# EAGLE design Sport Analyzer Chronojump Teensy 4 (4 buttons) Load cell 160Hz (EAGLE 9.6.2)
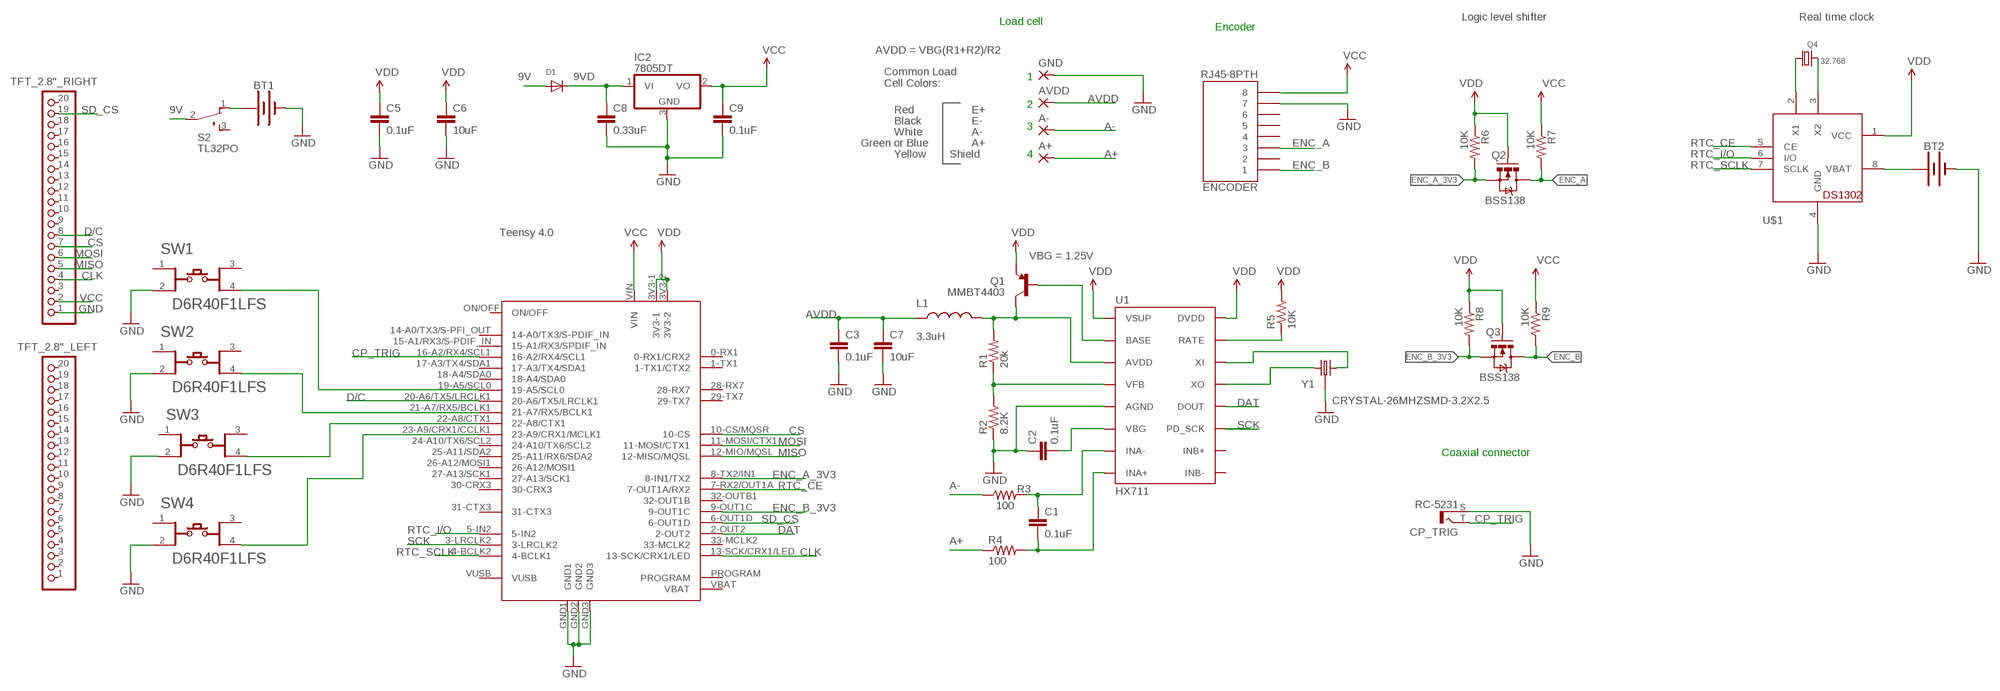
[diagram p0: schematic, sheet 1]

## Parts
A+  3,81/1,4  [3,81/1,4]
A-  3,81/1,4  [3,81/1,4]
AVDD  3,81/1,4  [3,81/1,4]
BT1  BATTERY-9V  [BATTCON_9V]
BT2  BATTERY-12MM_SMD  [BATTCON_12MM]
C1  0.1uF  0.1UF-25V-5%(0603)  [0603-CAP]
C2  0.1uF  0.1UF-25V-5%(0603)  [0603-CAP]
C3  0.1uF  0.1UF-25V-5%(0603)  [0603-CAP]
C5  0.1uF  0.1UF-25V-5%(0603)  [0603-CAP]
C6  10uF  10UF50V20%(1210)  [1210]
C7  10uF  10UF50V20%(1210)  [1210]
C8  0.33uF  0.1UF-25V-5%(0603)  [0603-CAP]
C9  0.1uF  0.1UF-25V-5%(0603)  [0603-CAP]
CP_TRIG  RC-5231  [RC-5231]
D1  DIODESOD-123  [SOD-123]
ENCODER  RJ45-8PTH  [RJ45-8]
GND  3,81/1,4  [3,81/1,4]
IC2  7805DT  [TO252]
L1  3.3uH  INDUCTOR0805-IND  [0805]
Q1  MMBT4403  TRANSISTOR_PNPMMBT4403  [SOT23-3]
Q2  BSS138  MOSFET-NCHANNELSMD  [SOT23-3]
Q3  BSS138  MOSFET-NCHANNELSMD  [SOT23-3]
Q4  32.768  CRYSTAL8.0X3.8  [CRYSTAL_8X3.8]
R1  20k  20KOHM1/10W1%(0603)  [0603-RES]
R2  8.2K  8.2KOHM-1/10W-5%(0603)  [0603-RES]
R3  100  100OHM-1/10W-1%(0603)  [0603-RES]
R4  100  100OHM-1/10W-1%(0603)  [0603-RES]
R5  10K  10KOHM-1/10W-1%(0603)0603  [0603-RES]
R6  10K  RESISTOR0603-RES  [0603-RES]
R7  10K  RESISTOR0603-RES  [0603-RES]
R8  10K  RESISTOR0603-RES  [0603-RES]
R9  10K  RESISTOR0603-RES  [0603-RES]
S2  TL32PO  [TL3XPO]
SW1  C&K_COMPONENTS_D6R40F1LFSC&K_COMPONENTS_D6R40F1LFS_0_0  [C&K_COMPONENTS_D6R40F1LFS_0]
SW2  C&K_COMPONENTS_D6R40F1LFSC&K_COMPONENTS_D6R40F1LFS_0_0  [C&K_COMPONENTS_D6R40F1LFS_0]
SW3  C&K_COMPONENTS_D6R40F1LFSC&K_COMPONENTS_D6R40F1LFS_0_0  [C&K_COMPONENTS_D6R40F1LFS_0]
SW4  C&K_COMPONENTS_D6R40F1LFSC&K_COMPONENTS_D6R40F1LFS_0_0  [C&K_COMPONENTS_D6R40F1LFS_0]
TFT_2.8"_LEFT  PINHD-1X20  [1X20]
TFT_2.8"_RIGHT  PINHD-1X20  [1X20]
U1  HX711  HX711HX711  [SO16]
U$1  DS1302  [DIL08-ROUND]
U$2  TEENSY40  [TEENSY40]
Y1  CRYSTAL-26MHZSMD-3.2X2.5  [CRYSTAL-SMD-3.2X2.5MM]

## Nets
9V: D1.A S2.2(P)
9VD: C8.1 D1.C IC2.1(VI)
A+: A+.1(P) R4.1
A-: A-.1(P) R3.1
AVDD: AVDD.1(P) C3.1 C7.1 L1.1
CLK: TFT_2.8"_RIGHT.4 U$2.13-SCK/CRX1/LED
CP_TRIG: CP_TRIG.T U$2.16-A2/RX4/SCL1
CS: TFT_2.8"_RIGHT.7 U$2.10-CS/MQSR(10-CS)
D/C: TFT_2.8"_RIGHT.8 U$2.20-A6/TX5/LRCLK1
DAT: U1.12(DOUT) U$2.2-OUT2
ENC_A: ENCODER.3 Q2.3(D) R7.2
ENC_A_3V3: Q2.2(S) R6.2 U$2.8-TX2/IN1(8-IN1/TX2)
ENC_B: ENCODER.1 Q3.3(D) R9.2
ENC_B_3V3: Q3.2(S) R8.2 U$2.9-OUT1C
GND: BT1.- BT2.GND(-) C2.1 C3.2 C5.2 C6.2 C7.2 C8.2 C9.2 CP_TRIG.S ENCODER.7 GND.1(P) IC2.3(GND) R2.1 SW1.2 SW2.2 SW3.2 SW4.2 TFT_2.8"_RIGHT.1 U1.5(AGND) U$1.4(GND) U$2.GND1 U$2.GND2 U$2.GND3 Y1.2(GND) Y1.4(GND)
MISO: TFT_2.8"_RIGHT.5 U$2.12-MIO/MQSL(12-MISO/MQSL)
MOSI: TFT_2.8"_RIGHT.6 U$2.11-MOSI/CTX1
N$1: R5.1 U1.15(RATE)
N$2: C1.1 R3.2 U1.7(INA-)
N$3: C1.2 R4.2 U1.8(INA+)
N$4: Q1.1(B) U1.2(BASE)
N$5: L1.2 Q1.3(C) R1.2 U1.3(AVDD)
N$6: R1.1 R2.2 U1.4(VFB)
N$7: C2.2 U1.6(VBG)
N$8: Q4.P$4 U$1.2(X1)
N$9: Q4.P$1 U$1.3(X2)
N$10: SW1.4 U$2.19-A5/SCL0
N$11: SW2.4 U$2.21-A7/RX5/BCLK1
N$12: SW3.4 U$2.22-A8/CTX1
N$13: SW4.4 U$2.23-A9/CRX1/CCLK1(23-A9/CRX1/MCLK1)
N$14: U1.13(XO) Y1.1
N$15: U1.14(XI) Y1.3
N$18: BT2.PWR@1(+) U$1.8(VBAT)
N$42: BT1.+ S2.1(O)
RTC_CE: U$1.5(CE) U$2.7-RX2/OUT1A(7-OUT1A/RX2)
RTC_I/O: U$1.6(I/O) U$2.5-IN2
RTC_SCLK: U$1.7(SCLK) U$2.4-BCLK2(4-BCLK1)
SCK: U1.11(PD_SCK) U$2.3-LRCLK2
SD_CS: TFT_2.8"_RIGHT.19 U$2.6-OUT1D
VCC: C9.1 ENCODER.8 IC2.2(VO) R7.1 R9.1 TFT_2.8"_RIGHT.2 U$2.VIN
VDD: C5.1 C6.1 Q1.2(E) Q2.1(G) Q3.1(G) R5.2 R6.1 R8.1 U1.1(VSUP) U1.16(DVDD) U$1.1(VCC) U$2.3V3-1 U$2.3V3-2
Unconnected: ENCODER.2 ENCODER.4 ENCODER.5 ENCODER.6 S2.3(S) SW1.1 SW1.3 SW2.1 SW2.3 SW3.1 SW3.3 SW4.1 SW4.3 TFT_2.8"_LEFT.1 TFT_2.8"_LEFT.2 TFT_2.8"_LEFT.3 TFT_2.8"_LEFT.4 TFT_2.8"_LEFT.5 TFT_2.8"_LEFT.6 TFT_2.8"_LEFT.7 TFT_2.8"_LEFT.8 TFT_2.8"_LEFT.9 TFT_2.8"_LEFT.10 TFT_2.8"_LEFT.11 TFT_2.8"_LEFT.12 TFT_2.8"_LEFT.13 TFT_2.8"_LEFT.14 TFT_2.8"_LEFT.15 TFT_2.8"_LEFT.16 TFT_2.8"_LEFT.17 TFT_2.8"_LEFT.18 TFT_2.8"_LEFT.19 TFT_2.8"_LEFT.20 TFT_2.8"_RIGHT.3 TFT_2.8"_RIGHT.9 TFT_2.8"_RIGHT.10 TFT_2.8"_RIGHT.11 TFT_2.8"_RIGHT.12 TFT_2.8"_RIGHT.13 TFT_2.8"_RIGHT.14 TFT_2.8"_RIGHT.15 TFT_2.8"_RIGHT.16 TFT_2.8"_RIGHT.17 TFT_2.8"_RIGHT.18 TFT_2.8"_RIGHT.20 U1.9(INB-) U1.10(INB+) U$2.0-RX1(0-RX1/CRX2) U$2.1-TX1(1-TX1/CTX2) U$2.14-A0/TX3/S-PFI_OUT(14-A0/TX3/S-PDIF_IN) U$2.15-A1/RX3/S-PDIF_IN(15-A1/RX3/SPDIF_IN) U$2.17-A3/TX4/SDA1 U$2.18-A4/SDA0 U$2.24-A10/TX6/SCL2 U$2.25-A11/SDA2(25-A11/RX6/SDA2) U$2.26-A12/MOSI1 U$2.27-A13/SCK1 U$2.28-RX7 U$2.29-TX7 U$2.30-CRX3 U$2.31-CTX3 U$2.32-OUTB1(32-OUT1B) U$2.33-MCLK2 U$2.ON/OFF U$2.PROGRAM U$2.VBAT U$2.VUSB

## Notes on the sheet
- Logic level shifter | Real time clock
- Load cell
- Encoder
- AVDD = VBG(R1+R2)/R2
- 1
- Common Load
  Cell Colors:
- 2
- Red | E+
- Black | E-
- 3
- White | A-
- Green or Blue | A+
- Yellow | Shield | 4
- Teensy 4.0
- VBG = 1.25V
- Coaxial connector

## Library data of the parts
A+ A- AVDD GND = wirepad_xavi:3,81/1,4: THROUGH-HOLE PAD
BT1 = SparkFun-Batteries:BATTERY: Battery - Single Cell A variety of battery chemistries, sizes, and footprints. Device List: 20MM_PTH - Coin Cell Battery Holder - 20mm (PTH) <https://www.sparkfun.com/products/783> 20MM_PTH_KIT- Coin Cell battery Holder - 20 mm (PTH) <http://www.sparkfun.com/products/783>kit version with special mask 6.8MM_PTH - Coin Cell Battery Holder - 6.8MM(SMD) <https://www.digikey.com/product-detail/en/seiko-instruments/MS621FE-FL11E/728-1057-ND/1889208?WT.srch=1&gclid=CNOQ5a6LzdQCFZS2wAodXCkE0g> 12MM_SMD - Coin Cell Battery Holder - 12mm (SMD) <https://www.sparkfun.com/products/10592> 12MM_PTH - Coin Cell Battery Holder - 12mm (PTH) <https://www.sparkfun.com/products/7948> 20MM_SMD - 20mm Coin Cell Battery Holder (SMD) (2 legs) Used on the Big Time Watch Kit <https://www.sparkfun.com/products/11734> 20MM_SMD_4LEGS - Coin Cell Battery Holder - 20mm (SMD) <https://www.sparkfun.com/products/11892> 20MM_SMD_4LEGS_OVERPASTE - Coin Cell Battery Holder - 20mm (SMD) <https://www.sparkfun.com/products/11892> (Over-paste on the legs) 24.5MM_PTH - Coin Cell Battery Holder - 24.5mm (PTH) <https://www.sparkfun.com/products/8863> 9V - 9V Battery Holder - PC Mount Used on the SparkFun SparkPunk Sound Kit <https://www.sparkfun.com/products/11177> and SparkFun SparkPunk Sequencer Kit <https://www.sparkfun.com/products/12707> 18650 - Battery Holder - 18650 (PTH) <https://www.sparkfun.com/products/13113> AA - Battery Holder - 1xAA (PTH) <https://www.sparkfun.com/products/7949> AAA - Battery Holder - 1xAAA (PTH) <https://www.sparkfun.com/products/12718> AA_KIT - Battery Holder - 1xAA (PTH) <https://www.sparkfun.com/products/7949> Special kit package - pads only have exposed copper on one side of the board. AAA_KIT - Battery Holder - 1xAAA (PTH) <https://www.sparkfun.com/products/12718> Special kit package - pads only have exposed copper on one side of the board.; PROD_ID: BATT-10855
BT2 = SparkFun-Batteries:BATTERY: Battery - Single Cell A variety of battery chemistries, sizes, and footprints. Device List: 20MM_PTH - Coin Cell Battery Holder - 20mm (PTH) <https://www.sparkfun.com/products/783> 20MM_PTH_KIT- Coin Cell battery Holder - 20 mm (PTH) <http://www.sparkfun.com/products/783>kit version with special mask 6.8MM_PTH - Coin Cell Battery Holder - 6.8MM(SMD) <https://www.digikey.com/product-detail/en/seiko-instruments/MS621FE-FL11E/728-1057-ND/1889208?WT.srch=1&gclid=CNOQ5a6LzdQCFZS2wAodXCkE0g> 12MM_SMD - Coin Cell Battery Holder - 12mm (SMD) <https://www.sparkfun.com/products/10592> 12MM_PTH - Coin Cell Battery Holder - 12mm (PTH) <https://www.sparkfun.com/products/7948> 20MM_SMD - 20mm Coin Cell Battery Holder (SMD) (2 legs) Used on the Big Time Watch Kit <https://www.sparkfun.com/products/11734> 20MM_SMD_4LEGS - Coin Cell Battery Holder - 20mm (SMD) <https://www.sparkfun.com/products/11892> 20MM_SMD_4LEGS_OVERPASTE - Coin Cell Battery Holder - 20mm (SMD) <https://www.sparkfun.com/products/11892> (Over-paste on the legs) 24.5MM_PTH - Coin Cell Battery Holder - 24.5mm (PTH) <https://www.sparkfun.com/products/8863> 9V - 9V Battery Holder - PC Mount Used on the SparkFun SparkPunk Sound Kit <https://www.sparkfun.com/products/11177> and SparkFun SparkPunk Sequencer Kit <https://www.sparkfun.com/products/12707> 18650 - Battery Holder - 18650 (PTH) <https://www.sparkfun.com/products/13113> AA - Battery Holder - 1xAA (PTH) <https://www.sparkfun.com/products/7949> AAA - Battery Holder - 1xAAA (PTH) <https://www.sparkfun.com/products/12718> AA_KIT - Battery Holder - 1xAA (PTH) <https://www.sparkfun.com/products/7949> Special kit package - pads only have exposed copper on one side of the board. AAA_KIT - Battery Holder - 1xAAA (PTH) <https://www.sparkfun.com/products/12718> Special kit package - pads only have exposed copper on one side of the board.; PROD_ID: BATT-08044; SF_SKU: PRT-10592
C1-C3 C5 C9 = SparkFun-Capacitors:0.1UF-25V-5%(0603): CAP-08604; PROD_ID: CAP-08604
C6 C7 = SparkFun-Capacitors:10UF50V20%(1210): CAP-09824; PROD_ID: CAP-09824
C8 = SparkFun-Capacitors:0.1UF-25V-5%(0603): CAP-08604; PROD_ID: CAP-08604; VALUE: 0.1uF
CP_TRIG = con-lumberg:RC-5231: RCA connectors according to JEITA RC-5231 RCA-Steckverbinder nach JEITA RC-5231 Source: RCA- Stecker 2poolig.pdf
D1 = adafruit:DIODE: Diode SMADIODE - SMA Surface Mount Package 20V 1A Schottky Diode Digikey: 641-1014-6-ND DO-1N4148 - Through Hole Small Current Diode SOD-123 20V 1 A (.5mV Vf) Schottky Diode - Digikey: MBRX120TPMSCT-ND SOD-323 10V 570mA (.38mV Vf, 3ns) Schottky Diode - Digikey: ZLLS410CT-ND SOD-523 30V 30mA Schottky Diode (RB751S-40TE61) - Digikey: RB751S-40TE61CT-ND SOT23-R/W - SOT23 Package (R = Solder Paste/Reflow Ovens, W = Hand-Soldering) BAT54Film 40V 300mA - Digikey: 497-7162-1-ND
ENCODER = SparkFun:RJ45-8: RJ45 Jack Simple RJ45, 8-pin connection - connector for common Cat5, Cat5e, and Cat6 Ethernet cables. Footprint not yet proven in production. Connector sku is PRT-00643; Breakout PCB sku is BOB-00716.
IC2 = linear:78*: Positive VOLTAGE REGULATOR Source: http://cache.national.com/ds/LM/LM78L05.pdf http://www.fairchildsemi.com/ds/LM/LM7805.pdf
L1 = SparkFun-Passives:INDUCTOR: Inductors Basic Inductor/Choke - 0603 and 1206. Footprints are not proven and vary greatly between part numbers. INDUCTOR POWER 3.3UH 4.0A SMD 0.197" L x 0.197" W x 0.177" H (5.00mm x 5.00mm x 4.50mm); PROD_ID: NDUC-13076
Q1 = SparkFun-DiscreteSemi:TRANSISTOR_PNP: Generic PNP BJT Double check pinouts against datasheets- not all devices are the same! MMBT3906 - 40V 200mA SOT-23 (TRANS-08052) MMBT4403 - 40V 600mA SOT-23 (TRANS-09245); PROD_ID: TRANS-09245
Q2 Q3 = SparkFun:MOSFET-NCHANNEL
Q4 = microbuilder:CRYSTAL: Crystals HC49UP - Surface Mount Crystal 4.0MHz 18pF +/-30ppm Surface Mount Crystal [Digikey: 535-9857-1-ND] 12.0 MHz Surface Mount Crystal [Digikey: 535-9869-6-ND] 25.0 MHz Surface Mount Crystal [Digikey: 535-9078-1-ND] 2.5 x 2.0mm - MEMs SMT Crystal 16.0 MHz 10pF 20ppm 2.5 x 2.0mm Crystal [Digikey -40-85°C: 535-10923-1-ND] 3.2 x 2.5mm - MEMs SMT Crystal 12.0 MHz 8pF 15ppm 3.2 x 2.5mm Crystal [Digikey: -10-70°C: 644-1047-1-ND -40-125°C: 644-1128-1-ND] 40~85°C cheaper: 644-1173-6-ND 16.0 MHz 8pF 15ppm 3.2 x 2.5mm Crystal [Digikey: -10-70°C: 644-1049-1-ND -40-125°C: 644-1129-2-ND]-40~85°C cheaper: 644-1175-6-ND 16.0 MHz 10pF 10ppm 3.2 x 2.5mm Crystal [Digikey: 644-1100-1-ND] 27.12 MHz 18pF 30ppm 3.2 x 2.5mm Crystal [Digikey: 887-1424-1-ND] 27.12MHz 10pF 10ppm 3.2 x 2.5mm Crystal [Digikey: 887-1329-1-ND] 4.9 x 1.8mm - MEMs SMT Crystal 32.768 KHz 12.5pF 20ppm 4.9 x 1.8mm Crystal [Digikey: SE2415CT-ND] 8.0 x 3.8mm - Surface Mount Crystal 32.768kHz 12.5pF 20ppm -40°C-85°C [Digikey: 535-9166-2-ND] Cylinder 32.768KHz Cylinder Crystal (2x6mm body) [Ex. Digikey: 300-8341-2-ND]
R1 = SparkFun-Resistors:20KOHM1/10W1%(0603): RES-09383; PROD_ID: RES-09383
R2 = SparkFun-Resistors:8.2KOHM-1/10W-5%(0603): RES-10646; PROD_ID: RES-10646
R3 R4 = SparkFun-Resistors:100OHM-1/10W-1%(0603): RES-07863; PROD_ID: RES-07863
R5 = SparkFun-Resistors:10KOHM-1/10W-1%(0603): RES-00824; PROD_ID: RES-00824
R6-R9 = SparkFun:RESISTOR: Resistor Basic schematic elements and footprints for 0603, 1206, and PTH resistors.
S2 = switch:TL32PO: TINY SWITCH ON - MOM Source: http://www2.produktinfo.conrad.com/datenblaetter/700000-724999/705152-da-01-de-Subminiaturschalter_TL_36YO.pdf
SW1-SW4 = C&K Components - D6R40F1LFS:C&K_COMPONENTS_D6R40F1LFS: Pushbutton Switch SPST-NO, RED, 0.1A, 32VDC, Through Hole; AUTOMOTIVE: No; CENTROID_NOT_SPECIFIED: No; CONTACT_CURRENT_RATING: 100mA; CONTACT_RESISTANCE: 100mΩ; DATASHEET: https://www.ckswitches.com/media/1341/d6.pdf; DEVICE_CLASS_L1: Electromechanical; DEVICE_CLASS_L2: Switches; DEVICE_CLASS_L3: Pushbutton Switches; DIGIKEY_DESCRIPTION: SWITCH PUSH SPST-NO 0.1A 32V; DIGIKEY_PART_NUMBER: 401-1975-ND; ELECTROMECHANICAL_LIFE: 250000Cycles; FOOTPRINT_VARIANT_NAME_0: Recommended_Land_Pattern; HEIGHT: 14.3mm; LEAD_FREE: Yes; MF: C&K Components; MFG_PACKAGE_IDENT: 0; MFG_PACKAGE_IDENT_DATE: 0; MFG_PACKAGE_IDENT_REV: 0; MOUNT: Through Hole; MOUSER_DESCRIPTION: Switch; P/B; Keyswitch; SPST-NO; OFF-MOM; Red Round Actuator; 100mA; 32VDC; PC Pins; MOUSER_PART_NUMBER: 611-D6R40F1LFS; MPN: D6R40F1LFS; OPERATING_FORCE: 1.3N; PACKAGE: PTH_SW_12MM0; PREFIX: SW; ROHS: Yes; STANDOFF_HEIGHT: 1.5mm; TEMPERATURE_RANGE_HIGH: +85°C; TEMPERATURE_RANGE_LOW: -20°C; THROW_CONFIGURATION: SPST-NO; VERIFICATION_VERSION: 0.0.0.3; VOLTAGE_RATING_DC: 32V
TFT_2.8"_LEFT TFT_2.8"_RIGHT = pinhead:PINHD-1X20: PIN HEADER
U1 = Testing:HX711; PROD_ID: IC-12445
U$1 = adafruit:DS1302: DS1302 - Real time clock with supercap trickle charger
U$2 = teensy:TEENSY40: Teensy 4.0 device including POGO pins for pins 24 - 33, but not yet pins for D+ and D-. Symbol layout is what works for me and may not suite everyone... that can be added or additional symbols can be created to be used in a modilied davie name.
Y1 = SparkFun-Clocks:CRYSTAL-26MHZ: 26MHz Crystal w/ Ground Pin Digikey Example <http://www.digikey.com/product-detail/en/epson/TSX-3225%2026.0000MF09Z-AC3/SER3627CT-ND/1802878> Frequency: 26MHz Frequency Stability: ±9ppm Frequency Tolerance: ±10ppm Load Capacitance: 9pF SparkFun Products: SparkFun ESP32 Thing <https://www.sparkfun.com/products/13907> SparkFun ESP8266 Thing Dev Board <https://www.sparkfun.com/products/13711>; PROD_ID: XTAL-12454

## Board
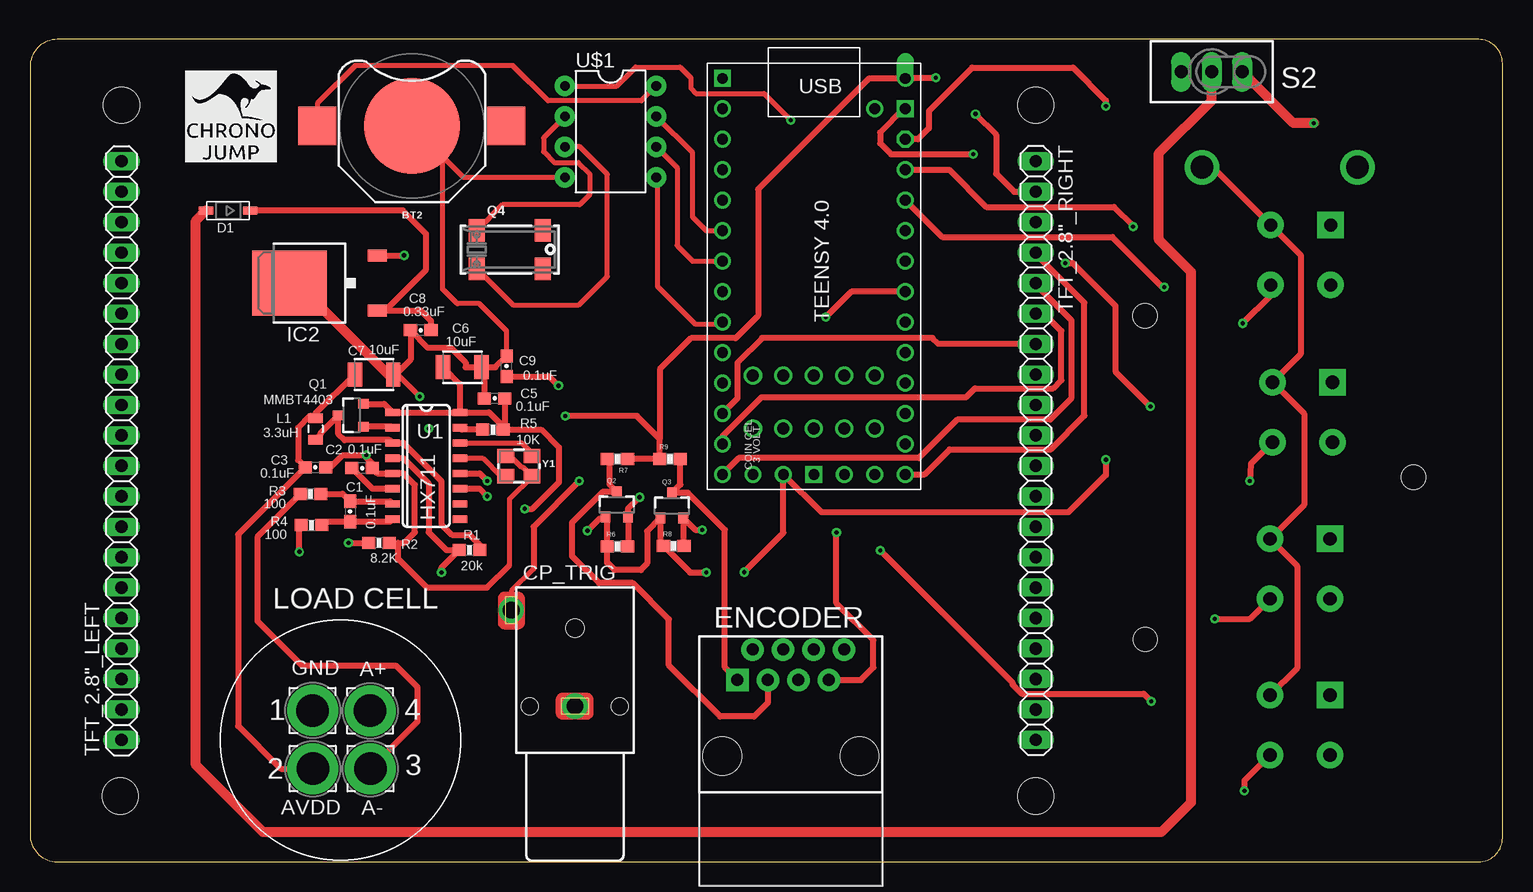
[diagram p1: board, top side]
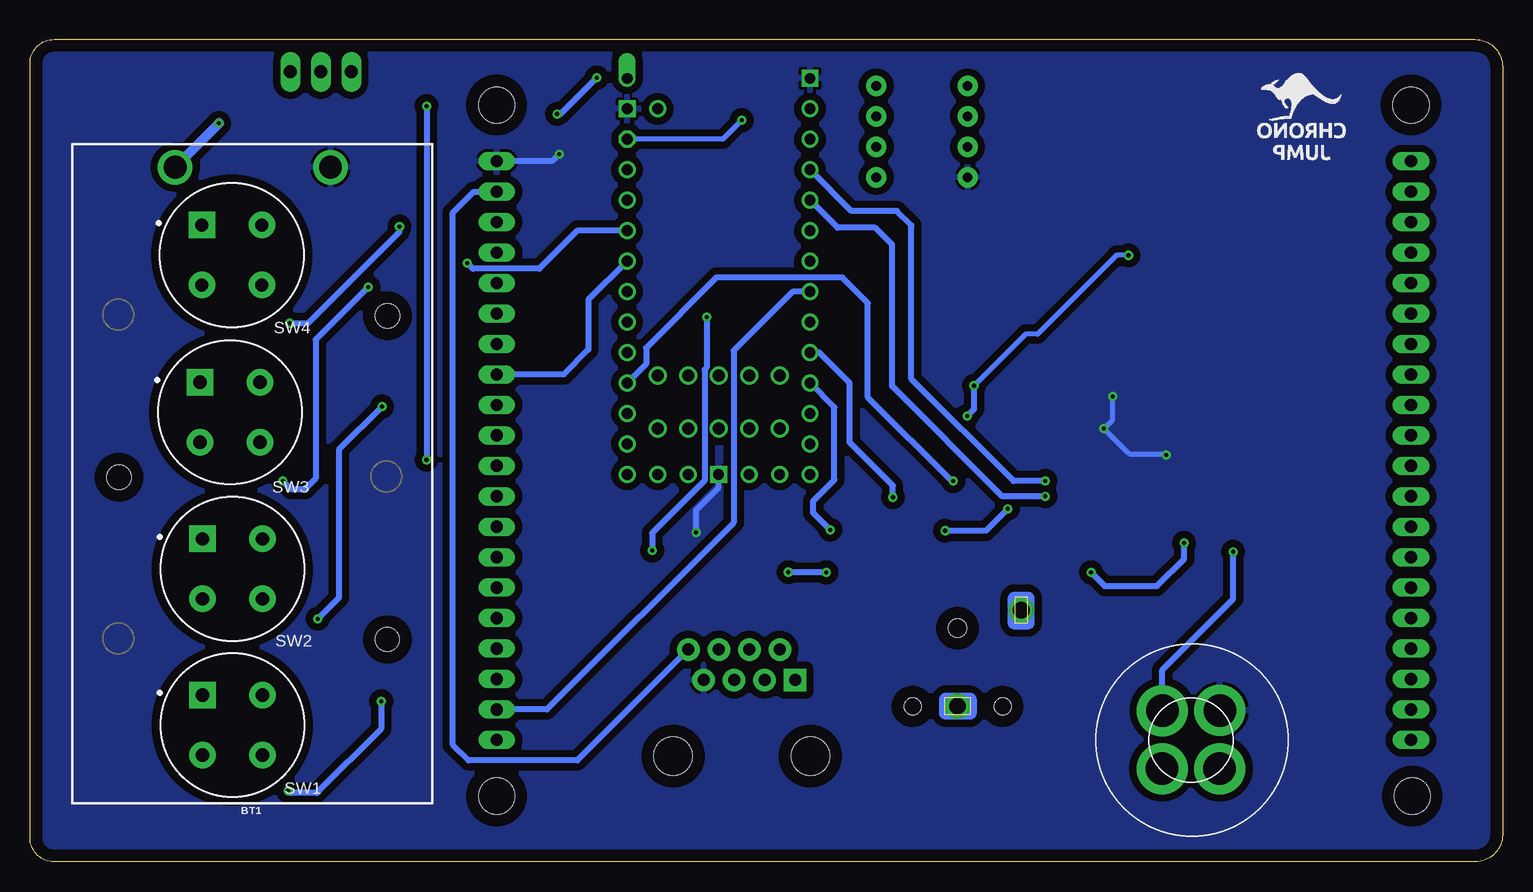
[diagram p2: board, bottom side, seen from below]

Size 122.71 x 68.57 mm. Coordinates in mm from the lower left corner, seen from the top.
Outline: 0,66.3 0,2.27 arc90 2.27,0 120.71,0 arc90 122.71,2 122.71,66.57 arc90 120.71,68.57 2.27,68.57 arc90 0,66.3
Copper layers (1*16): Top 0.035mm / dielectric 1.5mm / Bottom 0.035mm
Design rules "default": minimum track width 6mil, minimum drill 0.35mm, track to track 6mil, track to pad 6mil, pad to pad 6mil, via to via 6mil, smd to smd 6mil, copper to edge 40mil, drill to drill 6mil, minimum pad ring 10mil, minimum via ring 8mil, stop-mask expansion 4mil, vias tented up to drill 0mil, thermal gap 10mil
Holes 3 mm at 7.62,63.1 83.82,5.48 83.82,63.1 7.52,5.48
Holes 2 mm at 92.92,45.53 115.29,32.07 92.93,18.55

### Footprints (pad centres in the part's own frame; a part is rotated, then mirrored left to right if it is on the bottom)
3,81/1,4 = drill 2.7 pad 4.25: 1 0,0
BATTCON_9V = drill 1.905: + 0,0; - 0,-12.954
BATTCON_12MM = smd 8 x 8: GND 0,0 | smd 3.175 x 3.175: PWR@1 -7.874,0; PWR@2 7.874,0
0603-CAP = smd 1.1 x 1: 1 -0.85,0; 2 0.85,0
1210 = smd 1.2 x 2: 1 -1.6,0; 2 1.6,0
RC-5231 = drill 1.4 pad 1.778: S 0,0; T 5.3,-8 | hole 1.4: -3.75,0; 3.75,0 | hole 1.5: 0,-6.5
SOD-123 = smd 1.2 x 0.7: A 1.85,0; C -1.85,0
RJ45-8 = drill 1 pad 1.88 square: 1 -4.445,6.35 | drill 1 pad 1.88: 2 -3.175,8.89; 3 -1.905,6.35; 4 -0.635,8.89; 5 0.635,6.35; 6 1.905,8.89; 7 3.175,6.35; 8 4.445,8.89 | hole 3.2: -5.715,0; 5.715,0
TO252 = smd 1 x 1.6: 1 -2.28,-4.8; 2 2.28,-4.8 | smd 5.4 x 6.2: 3 0,2.5
0805 = smd 0.8 x 1.2: 1 -0.9,0; 2 0.9,0
SOT23-3 = smd 0.8 x 0.9: 1 -0.95,-1; 2 0.95,-1; 3 0,1.1
CRYSTAL_8X3.8 = smd 1.3 x 1.9: P$1 -2.75,-1.6; P$2 2.75,-1.6; P$3 2.75,1.6; P$4 -2.75,1.6
0603-RES = smd 1.1 x 1: 1 -0.85,0; 2 0.85,0
TL3XPO = drill 1.1 pad 1.422 long: 1 -2.54,0; 2 0,0; 3 2.54,0
C&K_COMPONENTS_D6R40F1LFS_0 = drill 1.1 pad 2.2 square: 1 -2.5,2.5 | drill 1.1 pad 2.2: 2 2.5,2.5; 3 -2.5,-2.5; 4 2.5,-2.5
1X20 = drill 1.016 long: 1 -24.13,0; 2 -21.59,0; 3 -19.05,0; 4 -16.51,0; 5 -13.97,0; 6 -11.43,0; 7 -8.89,0; 8 -6.35,0; 9 -3.81,0; 10 -1.27,0; 11 1.27,0; 12 3.81,0; 13 6.35,0; 14 8.89,0; 15 11.43,0; 16 13.97,0; 17 16.51,0; 18 19.05,0; 19 21.59,0; 20 24.13,0
SO16 = smd 0.6 x 1.2: 1 -4.445,-2.8; 2 -3.175,-2.8; 3 -1.905,-2.8; 4 -0.635,-2.8; 5 0.635,-2.8; 6 1.905,-2.8; 7 3.175,-2.8; 8 4.445,-2.8; 9 4.445,2.8; 10 3.175,2.8; 11 1.905,2.8; 12 0.635,2.8; 13 -0.635,2.8; 14 -1.905,2.8; 15 -3.175,2.8; 16 -4.445,2.8
DIL08-ROUND = drill 0.813 pad 1.676: 1 -3.81,-3.81; 2 -1.27,-3.81; 3 1.27,-3.81; 4 3.81,-3.81; 5 3.81,3.81; 6 1.27,3.81; 7 -1.27,3.81; 8 -3.81,3.81
TEENSY40 = drill 0.9: 0-RX1 -13.97,-7.62; 1-TX1 -11.43,-7.62; 2-OUT2 -8.89,-7.62; 3-LRCLK2 -6.35,-7.62; 3V3-2 16.51,-2.54; 4-BCLK2 -3.81,-7.62; 5-IN2 -1.27,-7.62; 6-OUT1D 1.27,-7.62; 7-RX2/OUT1A 3.81,-7.62; 8-TX2/IN1 6.35,-7.62; 9-OUT1C 8.89,-7.62; 10-CS/MQSR 11.43,-7.62; 11-MOSI/CTX1 13.97,-7.62; 12-MIO/MQSL 16.51,-7.62; 13-SCK/CRX1/LED 16.51,7.62; 14-A0/TX3/S-PFI_OUT 13.97,7.62; 15-A1/RX3/S-PDIF_IN 11.43,7.62; 16-A2/RX4/SCL1 8.89,7.62; 17-A3/TX4/SDA1 6.35,7.62; 18-A4/SDA0 3.81,7.62; 19-A5/SCL0 1.27,7.62; 20-A6/TX5/LRCLK1 -1.27,7.62; 21-A7/RX5/BCLK1 -3.81,7.62; 22-A8/CTX1 -6.35,7.62; 23-A9/CRX1/CCLK1 -8.89,7.62; ON/OFF 16.51,5.08; PROGRAM 16.51,2.54; VBAT 16.51,-5.08; VUSB -13.97,5.08 | drill 0.9 octagon: 3V3-1 -11.43,7.62 | drill 1: 24-A10/TX6/SCL2 12.7,5.08; 25-A11/SDA2 8.255,5.08; 26-A12/MOSI1 12.7,2.54; 27-A13/SCK1 8.255,2.54; 28-RX7 12.7,0; 29-TX7 8.255,0; 30-CRX3 12.7,-2.54; 31-CTX3 8.255,-2.54; 32-OUTB1 12.7,-5.08; 33-MCLK2 8.255,-5.08 | drill 0.9 square: GND1 -16.51,-7.62; GND2 16.51,0; GND3 -13.97,7.62 | drill 0.9 offset: VIN -16.51,7.62
CRYSTAL-SMD-3.2X2.5MM = smd 1.4 x 1.2: 1 -1.1,-0.85; 2 1.1,-0.85; 3 1.1,0.85; 4 -1.1,0.85

### Placement (x,y rotation side)
A+  28.34,12.6 0 top
A-  28.37,7.77 0 top
AVDD  23.57,7.77 0 top
BT1  110.62,57.91 90 bottom
BT2  31.82,61.36 0 top
C1  26.67,29.21 270 top
C2  27.67,32.82 180 top
C3  23.79,32.89 0 top
C5  38.71,38.64 180 top
C6  36.03,41.24 0 top
C7  28.67,40.64 0 top
C8  32.56,44.32 180 top
C9  39.71,41.32 90 top
CP_TRIG  45.41,12.98 180 top
D1  16.5,54.3 180 top
ENCODER  63.4,8.81 0 top
GND  23.54,12.62 0 top
IC2  24.13,48.26 90 top
L1  23.79,36.1 270 top
Q1  26.8,37.23 90 top
Q2  48.89,29.77 0 top
Q3  53.49,29.66 0 top
Q4  39.98,51.05 0 top
R1  36.63,26 0 top
R2  29.08,26.6 180 top
R3  23.39,30.68 0 top
R4  23.46,28.07 0 top
R5  38.57,36.03 0 top
R6  48.94,26.31 0 top
R7  48.94,33.58 180 top
R8  53.64,26.34 0 top
R9  53.34,33.6 0 top
S2  98.47,65.87 180 top
SW1  105.84,11.4 0 bottom
SW2  105.84,24.43 0 bottom
SW3  106.04,37.49 0 bottom
SW4  105.89,50.59 0 bottom
TFT_2.8"_LEFT  7.62,34.29 90 top
TFT_2.8"_RIGHT  83.82,34.29 270 top
U1  33.02,33.02 270 top
U$1  48.39,60.88 270 top
U$2  65.33,48.82 270 top
Y1  40.74,32.99 0 top

### Tracks (layer width: path | path; a pad name or v marks a point on that pad's centre or on a via)
9V
  Top 0.813: S2.2 98.47,63.48 94.07,59.08 94.07,51.87 96.76,49.18 96.76,4.96 94.27,2.47 19.42,2.47 13.82,8.08 13.82,53.46 D1.A
9VD
  Top 0.508: C8.1 33.41,45.12 32.55,45.98 IC2.1 29.6,45.98 33.02,49.4 33.02,52.35 31.06,54.3 D1.C
A+  (via drill 0.35)
  Top 0.508: v22.45,25.85 22.45,27.91 R4.1
  Bottom 0.508: A+.1 28.34,16.02 22.45,21.92 v22.45,25.85
A-
  Top 0.508: A-.1 32.28,11.68 32.28,14.58 30.48,16.38 22.65,16.38 18.95,20.09 18.95,27.09 R3.1
AVDD
  Top 0.508: C7.1 23.79,37.36 L1.1 23.62,37.17 23.32,37.17 22.34,36.19 22.34,33.49 C3.1 17.35,27.3 17.35,11.32 20.9,7.77 AVDD.1
CLK
  Top 0.508: TFT_2.8"_RIGHT.4 83.82,50.67 87.87,46.62 87.87,37.2 85.07,34.39 76.63,34.39 74.55,32.31 U$2.13-SCK/CRX1/LED
CP_TRIG  (via drill 0.35)
  Top 0.406: 41.96,24.43 40.11,22.59 CP_TRIG.T
  Top 0.508: v45.77,31.75 41.96,27.94 41.96,24.43
  Bottom 0.508: v45.77,31.75 45.9,31.75 52.88,38.73 52.88,46.58 55.01,48.71 65.5,48.71 71.37,42.85 71.37,41.5 U$2.16-A2/RX4/SCL1
CS
  Top 0.508: TFT_2.8"_RIGHT.7 75.71,43.18 75.21,43.69 61.01,43.69 58.95,41.63 58.95,38.63 U$2.10-CS/MQSR
D/C
  Bottom 0.508: U$2.20-A6/TX5/LRCLK1 76.17,46.86 76.17,42.69 78.23,40.64 TFT_2.8"_RIGHT.8
DAT  (via drill 0.35)
  Top 0.508: U1.12 37.47,32.38 v38.1,31.75
  Bottom 0.508: v38.1,31.75 40.75,31.75 49.27,40.27 49.27,53.07 50.47,54.27 54.27,54.27 U$2.2-OUT2
ENC_A
  Top 0.508: R7.2 48.28,33.39 48.28,31.48 Q2.3 47.76,30.87 45.19,28.29 45.19,25.47 47.42,23.24 50.21,23.24 53.24,20.21 53.24,16.38 57.5,12.11 60.35,12.11 61.5,13.26 ENCODER.3
ENC_A_3V3  (via drill 0.35)
  Top 0.508: R6.2 49.84,26.36 Q2.2 49.84,29.45 v50.8,30.4
  Bottom 0.508: v50.8,30.4 50.8,31.37 54.41,34.97 54.41,39.93 56.95,42.47 U$2.8-TX2/IN1
ENC_B
  Top 0.508: ENCODER.1 57.91,16.2 57.91,27.68 54.83,30.76 Q3.3 54.19,31.46 R9.2
ENC_B_3V3  (via drill 0.35)
  Top 0.508: R8.2 54.44,26.39 Q3.2 55.42,27.68 v56.03,27.68
  Bottom 0.508: v56.03,27.68 57.45,29.11 57.45,30.07 55.68,31.85 55.68,37.89 U$2.9-OUT1C
GND  (via drill 0.35)
  Top 0.406: C7.2 30.65,40.64 v32.48,38.81 | BT2.GND 34.39,58.8 | 34.39,58.8 36.12,57.07 U$1.4 | C9.2 39.71,44.26 37.44,46.53 35.61,46.53 34.39,47.75 34.39,58.8 | 39.93,24.69 39.98,24.74 39.98,30.28 Y1.2 41.09,32.89 40.99,32.89 40.04,33.84 Y1.4 | v28.02,33.93 28.05,33.9 27.95,33.79
  Top 0.508: C2.1 28.95,32.38 U1.5 31.11,32.38 32.07,31.43 32.07,27.47 31.2,26.6 30.67,26.6 | C2.1 28.32,33.02 | 39.93,24.69 38.1,22.86 33.07,22.86 30.67,25.26 30.67,26.6 | C7.2 30.47,40.64 31.71,41.88 C8.2 33.16,42.87 35.07,42.87 36.3,41.64 36.3,41.24 C6.2 | C2.1 28.52,33.22 27.95,33.79 | 27.87,33.87 26.02,33.87 25.04,32.89 C3.2 | C6.2 37.86,41.01 C5.2 | C6.2 38.78,41.24 C9.2 | R2.1 30.67,26.6 | ENCODER.7 69.24,15.16 70.28,16.2 70.28,18.49 67.21,21.56 v67.21,27.45 | U$2.GND3 72.82,62.79 70.84,60.8 70.84,59.92 71.75,59 v78.61,59 | BT1.- 98.57,57.91 SW4.2 105.89,50.59 105.89,42.34 SW3.2 106.17,37.36 106.17,29.76 SW2.2 105.59,24.69 105.59,16.15 SW1.2
  Top 0.813: IC2.3 22.23,48.26 29.85,40.64 C7.2
  Bottom 0.406: v32.48,38.81 32.54,38.76 32.54,36.8 33.2,36.14 v33.22,36.14 31.09,34.01 28.12,34.01 28.05,33.93 v28.02,33.93
  Bottom 0.508: TFT_2.8"_RIGHT.1 83.82,58.47 79.14,58.47 v78.61,59 | v67.21,27.45 67.21,29.33 65.33,31.21 U$2.GND2
  pour Bottom (isolate 0.61): 120.84,68.58 2,68.58 arc90 -0.13,66.45 -0.13,2.13 arc90 2,0 121.57,0 123.14,1.57 123.14,66.28 arc90
MISO
  Top 0.508: TFT_2.8"_RIGHT.5 83.82,48.13 86.81,45.14 86.81,38.68 85,36.87 77.28,36.87 74.06,33.65 59.05,33.65 U$2.12-MIO/MQSL
MOSI
  Top 0.508: TFT_2.8"_RIGHT.6 84.49,45.72 85.95,44.26 85.95,40.16 85.27,39.47 78.74,39.47 78,38.73 60.96,38.73 57.71,35.48 U$2.11-MOSI/CTX1
N$1
  Top 0.508: R5.1 35.98,36.03 U1.15
N$2
  Top 0.508: R3.2 26.05,30.68 C1.1 30,30.06 U1.7
N$3
  Top 0.508: U1.8 30,28.36 C1.2 24.6,28.36 R4.2
N$4
  Top 0.508: U1.2 30.13,36.28 Q1.1
N$5
  Top 0.508: R1.2 37.48,26.42 36.63,27.27 35.16,27.27 34.29,28.14 34.29,31.75 31.11,34.92 U1.3 29.99,35.15 26.21,35.15 25.7,35.66 Q1.3 24.22,35.75 24.22,35.63 L1.2
N$6  (via drill 0.35)
  Top 0.508: U1.4 31.11,33.66 33.22,31.55 33.22,27.47 34.69,26 R1.1 34.29,24.51 v34.29,24.13 | v26.54,26.6 R2.2
  Bottom 0.508: v34.29,24.13 33.15,22.99 28.81,22.99 26.54,25.26 v26.54,26.6
N$7
  Top 0.508: C2.2 28.52,31.11 U1.6
N$8
  Top 0.406: U$1.2 42.8,60.37 42.8,59.2 43.69,58.31 45.69,58.31 46.63,57.38 46.63,55.62 45.79,54.78 39.36,54.78 Q4.P$4
N$9
  Top 0.406: Q4.P$1 40.25,46.43 45.72,46.43 48.11,48.82 48.11,57.33 45.82,59.61 U$1.3
N$10  (via drill 0.35)
  Top 0.508: U$2.19-A5/SCL0 68.45,47.55 v66.32,45.41 | v70.86,25.96 81.89,14.93 81.89,14.76 82.63,14.02 92.81,14.02 v93.44,13.38 | v101.2,5.93 101.2,6.76 SW1.4
  Bottom 0.508: v66.32,45.41 66.32,41.21 66.49,41.04 66.49,31.78 70.86,27.4 v70.86,25.96 | v93.44,13.38 93.44,11.1 98.8,5.74 101.01,5.74 v101.2,5.93
N$11  (via drill 0.35)
  Top 0.508: v86.28,49.93 86.89,49.93 90.45,46.38 90.45,40.89 v93.37,37.97 | v98.73,20.27 101.67,20.27 SW2.4
  Bottom 0.508: U$2.21-A7/RX5/BCLK1 77.09,52.63 80.26,49.45 85.8,49.45 v86.28,49.93 | v93.37,37.97 96.97,34.36 96.97,22.02 v98.73,20.27
N$12  (via drill 0.35)
  Top 0.508: U$2.22-A8/CTX1 76.02,52.09 90.19,52.09 94.36,47.93 v94.51,47.93 | SW3.4 101.74,33.18 v101.63,31.76
  Bottom 0.508: v94.51,47.93 98.91,43.53 98.91,31.95 99.76,31.1 100.97,31.1 v101.63,31.76
N$13  (via drill 0.35)
  Top 0.508: U$2.23-A9/CRX1/CCLK1 76.6,57.71 79.7,54.61 90.32,54.61 91.92,53.01 v91.92,52.96 | v101.06,44.9 103.39,47.23 SW4.4
  Bottom 0.508: v91.92,52.96 91.92,52.52 99.54,44.9 v101.06,44.9
N$14
  Top 0.406: U1.13 37.71,33.66 39.23,32.14 Y1.1
N$15
  Top 0.406: U1.14 40.97,34.92 41.84,34.05 Y1.3
N$18
  Top 0.406: U$1.8 50.95,63.45 43.18,63.45 40.23,66.39 27.1,66.39 23.95,63.24 BT2.PWR@1
N$42  (via drill 0.35)
  Top 0.813: v106.98,61.59 105.29,61.59 S2.1
  Bottom 0.813: BT1.+ 106.98,61.55 v106.98,61.59
RTC_CE
  Top 0.406: U$1.5 52.27,56.99 52.27,48 55.42,44.85 57.55,44.85 U$2.7-RX2/OUT1A
RTC_I/O
  Top 0.406: U$1.6 53.92,57.88 53.92,51.38 55.22,50.09 U$2.5-IN2
RTC_SCLK
  Top 0.406: U$1.7 55.19,59.15 55.19,53.79 56.36,52.63 U$2.4-BCLK2
SCK  (via drill 0.35)
  Top 0.508: U1.11 37.47,31.11 v38.1,30.48
  Bottom 0.508: v38.1,30.48 41.68,30.48 50.87,39.67 50.87,51.47 52.27,52.87 55.41,52.87 U$2.3-LRCLK2
SD_CS
  Bottom 0.508: TFT_2.8"_RIGHT.19 79.64,12.7 64.08,28.26 64.08,42.62 59.16,47.55 U$2.6-OUT1D
VCC  (via drill 0.35)
  Top 0.508: C9.1 43.27,40.47 v44.04,39.7 | v31.17,50.57 31.07,50.47 31,50.54 IC2.2 | R7.1 52.46,33.58 R9.1 52.49,35.26 | v44.6,37.18 50.57,37.18 52.49,35.26 | v75.49,65.38 73,65.38 U$2.VIN 69.92,65.33 60.68,56.08 60.68,45.54 58.8,43.66 55.07,43.66 52.49,41.08 52.49,35.26 | v78.79,62.35 80.52,60.63 80.52,57.38 82.01,55.88 TFT_2.8"_RIGHT.2
  Bottom 0.406: v31.17,50.57 32.15,50.57 38.73,43.99 39.75,43.99 v44.04,39.7
  Bottom 0.508: ENCODER.8 77.09,8.46 86.16,8.46 87.48,9.78 87.48,54.12 85.72,55.88 TFT_2.8"_RIGHT.2 | v44.6,37.18 44.04,37.74 v44.04,39.7 | v75.49,65.38 78.51,62.35 v78.79,62.35
VDD  (via drill 0.35)
  Top 0.406: U$1.1 48.89,64.69 50.47,66.27 54.18,66.27 55.07,65.38 55.07,64.49 55.5,64.06 61.19,64.06 v63.4,61.85
  Top 0.508: Q1.2 29.5,38.18 U1.1 U1.16 | C6.1 35.82,39.85 U1.16 | C5.1 39.56,36.17 | 39.56,36.17 R5.2 42.59,36.03 44.07,34.56 44.07,31.64 41.86,29.44 v41.22,29.44 | U1.16 38.27,37.46 39.56,36.17 | 48.09,28.61 R6.1 48.09,24.95 48.72,24.33 50.9,24.33 51.43,24.86 51.43,27.56 Q3.1 52.54,26.59 R8.1 55,24.13 v56.36,24.13 | 48.09,28.61 Q2.1 | v46.46,27.61 47.46,28.61 48.09,28.61 | v59.51,24.15 62.79,27.43 U$2.3V3-2 65.96,29.13 86.54,29.13 89.66,32.26 v89.66,33.52 | U$2.3V3-1 73.99,60.25 74.9,61.16 74.9,62.61 78.51,66.22 86.92,66.22 89.66,63.47 v89.66,63.01
  Bottom 0.406: v63.4,61.85 65,60.25 U$2.3V3-1
  Bottom 0.508: v41.22,29.44 43.05,27.61 v46.46,27.61 | v56.36,24.13 59.48,24.13 v59.51,24.15 | v89.66,63.01 v89.66,33.52

### Text on the board
tNames: LOAD CELL | ENCODER | 1 | 4 | 2 | 3